# Altium schematic sheet BOTTOM_BOARD_TRANS.SchDoc
size A1
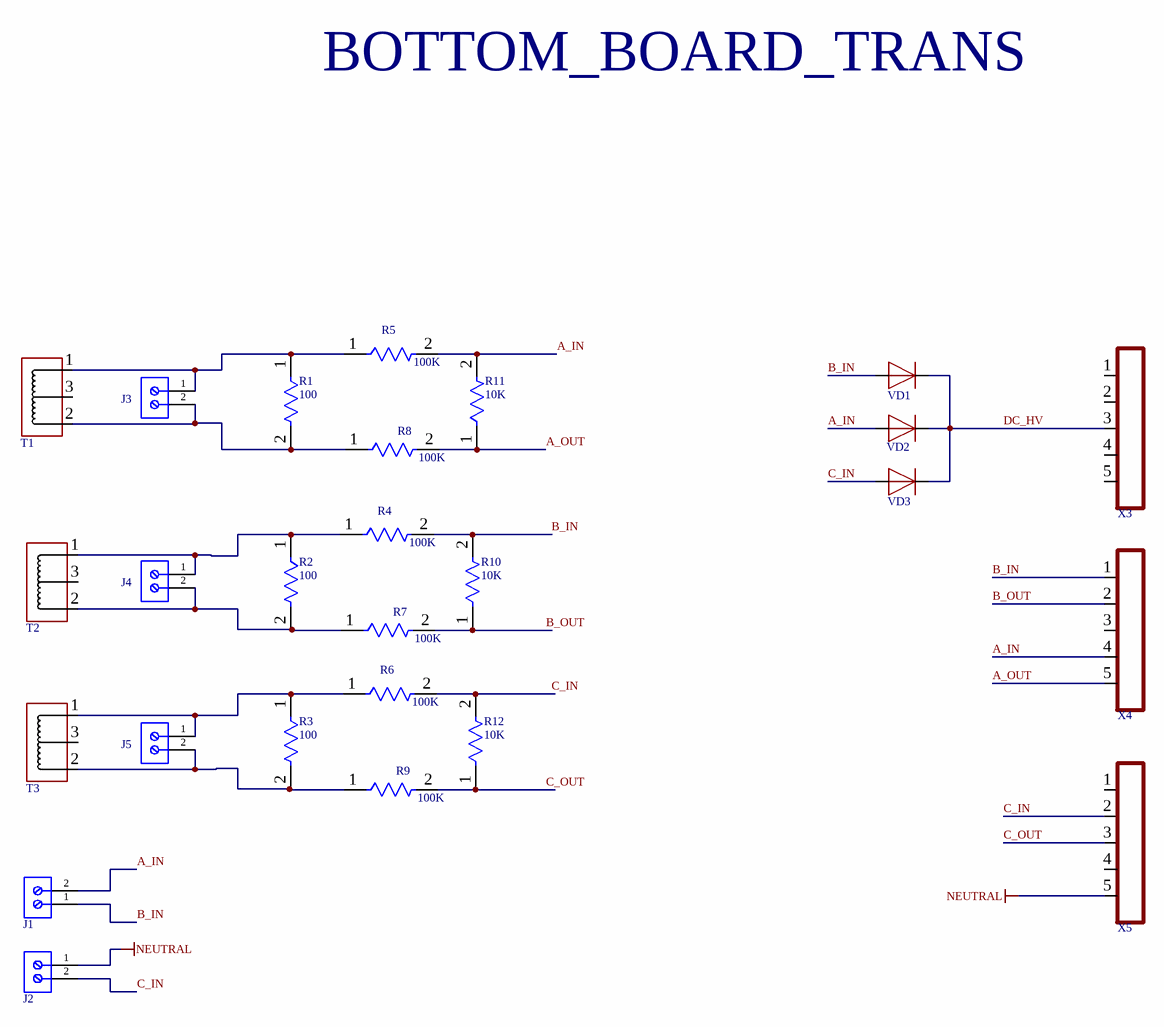
[diagram p0: BOTTOM_BOARD_TRANS.SchDoc]

## Parts
J1  691213510002  [691213510002]  (value not drawn)
J2  691213510002  [691213510002]  (value not drawn)
J3  691213510002  [691213510002]  (value not drawn)
J4  691213510002  [691213510002]  (value not drawn)
J5  691213510002  [691213510002]  (value not drawn)
R1  100  [RES-2512]
R2  100  [RES-2512]
R3  100  [RES-2512]
R4  100K  [RES-0805]
R5  100K  [RES-0805]
R6  100K  [RES-0805]
R7  100K  [RES-0805]
R8  100K  [RES-0805]
R9  100K  [RES-0805]
R10  10K  [RES-0805]
R11  10K  [RES-0805]
R12  10K  [RES-0805]
T1  AC1005  [AC1005]  (value not drawn)
T2  AC1005  [AC1005]  (value not drawn)
T3  AC1005  [AC1005]  (value not drawn)
VD1  DIODE  [DO-214BA]  (value not drawn)
VD2  DIODE  [DO-214BA]  (value not drawn)
VD3  DIODE  [DO-214BA]  (value not drawn)
X3  CONN-5-PIN  [CONN-PLS-5-2.54mm]  (value not drawn)
X4  CONN-5-PIN  [CONN-PLS-5-2.54mm]  (value not drawn)
X5  CONN-5-PIN  [CONN-PLS-5-2.54mm]  (value not drawn)

## Nets
NEUTRAL: J2.1 X5.5
A_IN: J1.2 R5.2 R11.2 VD2.2(A) X4.4
A_OUT: R8.2 R11.1 X4.5
B_IN: J1.1 R4.2 R10.2 VD1.2(A) X4.1
B_OUT: R7.2 R10.1 X4.2
C_IN: J2.2 R6.2 R12.2 VD3.2(A) X5.2
C_OUT: R9.2 R12.1 X5.3
DC_HV: VD1.1(C) VD2.1(C) VD3.1(C) X3.3
NetJ3_1: J3.1 R1.1 R5.1 T1.1
NetJ3_2: J3.2 R1.2 R8.1 T1.2
NetJ4_1: J4.1 R2.1 R4.1 T2.1
NetJ4_2: J4.2 R2.2 R7.1 T2.2
NetJ5_1: J5.1 R3.1 R6.1 T3.1
NetJ5_2: J5.2 R3.2 R9.1 T3.2

Not connected (* = marked no-connect by the designer): T1 3; T2 3; T3 3; X3 1 2 4 5; X4 3; X5 1 4

## Notes on the sheet
- BOTTOM_BOARD_TRANS

## Library data of the parts
J1-J5 = 691213510002: WR-TBL Series 2135 Horizontal Entry Modular, THT, pitch 5.08mm, 2p; Manufacturer: Wurth Elektronik; Modularity: Yes; Rated Current: 14A; Working Voltage: 300V; ComponentLink1Description: Website Link; ComponentLink1URL: https://www.we-online.com/redexpert/article/691213510002?ad; ComponentLink2Description: Datasheet Link; ComponentLink2URL: https://www.we-online.com/redexpert/spec/691213510002?ad; Manufacturer Part Number: 691213510002; Category: Terminal Blocks; Match Code: WR-TBL; Mount: Through Hole; Operating Temperature Max: 120°C; Operating Temperature Min: -30°C; Packaging: Box; Application: Rising Cage Clamp; Number of Pins: 2; Number of Rows: 1; Orientation: Horizontal; Pitch: 5.08mm
R1-R9 = RES-CONST: 10K
R10-R12 = RES-CONST